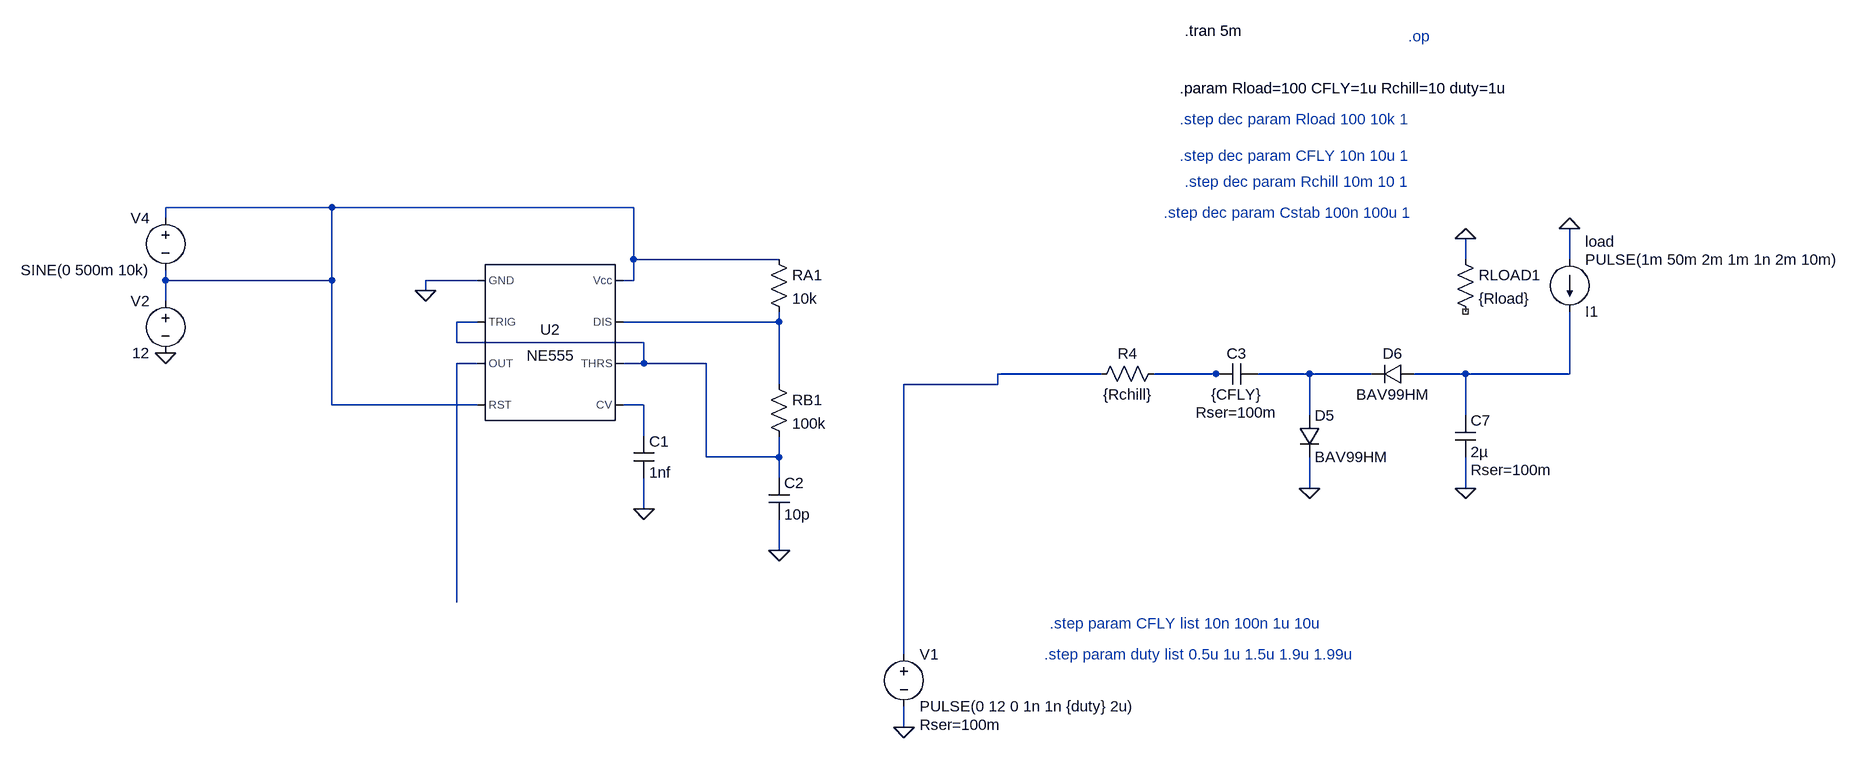
[diagram p0: schematic negrail.asc]
negrail.asc, the LTspice schematic file:
Version 4
SHEET 1 2992 1652
WIRE -352 608 -608 608
WIRE 112 608 -352 608
WIRE -608 624 -608 608
WIRE 112 688 112 608
WIRE 336 688 112 688
WIRE 1392 688 1392 656
WIRE 1552 688 1552 640
WIRE -608 720 -608 704
WIRE -352 720 -352 608
WIRE -352 720 -608 720
WIRE -128 720 -208 720
WIRE 112 720 112 688
WIRE 112 720 96 720
WIRE -208 736 -208 720
WIRE -608 752 -608 720
WIRE -128 784 -160 784
WIRE 336 784 336 768
WIRE 336 784 96 784
WIRE -160 816 -160 784
WIRE 128 816 -160 816
WIRE -128 848 -160 848
WIRE 128 848 128 816
WIRE 128 848 96 848
WIRE 224 848 128 848
WIRE 832 864 672 864
WIRE 1008 864 912 864
WIRE 1024 864 1008 864
WIRE 1152 864 1072 864
WIRE 1248 864 1152 864
WIRE 1392 864 1312 864
WIRE 1552 864 1552 768
WIRE 1552 864 1392 864
WIRE 336 880 336 784
WIRE 672 880 672 864
WIRE 672 880 528 880
WIRE -352 912 -352 720
WIRE -128 912 -352 912
WIRE 128 912 96 912
WIRE 1152 928 1152 864
WIRE 1392 928 1392 864
WIRE 128 960 128 912
WIRE 224 992 224 848
WIRE 336 992 336 960
WIRE 336 992 224 992
WIRE 336 1024 336 992
WIRE 1152 1040 1152 992
WIRE 1392 1040 1392 992
WIRE 128 1072 128 1024
WIRE 336 1136 336 1088
WIRE -160 1216 -160 848
WIRE 528 1296 528 880
WIRE 528 1408 528 1376
FLAG -208 736 0
FLAG 128 1072 0
FLAG 336 1136 0
FLAG -608 832 0
FLAG 1152 1040 0
FLAG 1392 1040 0
FLAG 1392 656 0
FLAG 1552 640 0
FLAG 528 1408 0
SYMBOL voltage -608 736 M0
WINDOW 123 0 0 Left 0
WINDOW 39 24 124 Left 2
SYMATTR InstName V2
SYMATTR Value 12
SYMBOL voltage -608 608 M0
WINDOW 123 0 0 Left 0
WINDOW 39 0 0 Left 0
SYMATTR InstName V4
SYMATTR Value SINE(0 500m 10k)
SYMBOL Misc\\NE555 -16 816 R0
SYMATTR InstName U2
SYMBOL cap 112 960 R0
SYMATTR InstName C1
SYMATTR Value 1nf
SYMBOL res 320 672 R0
SYMATTR InstName RA1
SYMATTR Value 10k
SYMBOL cap 320 1024 R0
SYMATTR InstName C2
SYMATTR Value 10p
SYMBOL res 320 864 R0
SYMATTR InstName RB1
SYMATTR Value 100k
SYMBOL cap 1072 848 R90
WINDOW 0 0 32 VBottom 2
WINDOW 3 32 32 VTop 2
WINDOW 39 60 32 VTop 2
SYMATTR InstName C3
SYMATTR Value {CFLY}
SYMATTR SpiceLine Rser=100m
SYMBOL cap 1376 928 R0
WINDOW 39 24 84 Left 2
SYMATTR SpiceLine Rser=100m
SYMATTR InstName C7
SYMATTR Value 2µ
SYMBOL res 1376 672 R0
SYMATTR InstName RLOAD1
SYMATTR Value {Rload}
SYMBOL current 1552 688 R0
WINDOW 0 24 80 Left 2
WINDOW 3 24 0 Left 2
WINDOW 123 0 0 Left 0
WINDOW 39 24 -28 Left 2
SYMATTR InstName I1
SYMATTR Value PULSE(1m 50m 2m 1m 1n 2m 10m)
SYMATTR SpiceLine load
SYMBOL res 928 848 R90
WINDOW 0 0 56 VBottom 2
WINDOW 3 32 56 VTop 2
SYMATTR InstName R4
SYMATTR Value {Rchill}
SYMBOL diode 1136 928 R0
SYMATTR InstName D5
SYMATTR Value BAV99HM
SYMBOL diode 1312 848 R90
WINDOW 0 0 32 VBottom 2
WINDOW 3 32 32 VTop 2
SYMATTR InstName D6
SYMATTR Value BAV99HM
SYMBOL voltage 528 1280 R0
WINDOW 123 0 0 Left 0
WINDOW 39 24 124 Left 2
SYMATTR SpiceLine Rser=100m
SYMATTR InstName V1
SYMATTR Value PULSE(0 12 0 1n 1n {duty} 2u)
TEXT 960 336 Left 2 !.tran 5m
TEXT 1304 344 Left 2 ;.op
TEXT 952 472 Left 2 ;.step dec param Rload 100 10k 1
TEXT 952 424 Left 2 !.param Rload=100 CFLY=1u Rchill=10 duty=1u
TEXT 952 528 Left 2 ;.step dec param CFLY 10n 10u 1
TEXT 960 568 Left 2 ;.step dec param Rchill 10m 10 1
TEXT 928 616 Left 2 ;.step dec param Cstab 100n 100u 1
TEXT 744 1296 Left 2 ;.step param duty list 0.5u 1u 1.5u 1.9u 1.99u
TEXT 752 1248 Left 2 ;.step param CFLY list 10n 100n 1u 10u

The netlist it stands for:
* negrail.asc
V2 N001 0 12
V4 N001 N001 SINE(0 500m 10k)
XU2 0 N002 N004 N001 N009 N002 N003 N001 NE555  ; pins GND TRIG OUT RST CV THRS DIS Vcc
C1 N009 0 1nf
RA1 N001 N003 10k
C2 N002 0 10p
RB1 N003 N002 100k
C3 N007 N006 {CFLY} Rser=100m
C7 N008 0 2µ Rser=100m
RLOAD1 0 NC_01 {Rload}
I1 0 N008 PULSE(1m 50m 2m 1m 1n 2m 10m) load
R4 N006 N005 {Rchill}
D5 N007 0 BAV99HM
D6 N008 N007 BAV99HM
V1 N005 0 PULSE(0 12 0 1n 1n {duty} 2u) Rser=100m
.model D D
.lib standard.dio
.tran 5m
* .op
* .step dec param Rload 100 10k 1
.param Rload=100 CFLY=1u Rchill=10 duty=1u
* .step dec param CFLY 10n 10u 1
* .step dec param Rchill 10m 10 1
* .step dec param Cstab 100n 100u 1
* .step param duty list 0.5u 1u 1.5u 1.9u 1.99u
* .step param CFLY list 10n 100n 1u 10u
.lib NE555.sub
.backanno
.end